# Altium schematic sheet WIFI.SchDoc
size A; SheetNumber: 11; SheetTotal: 15
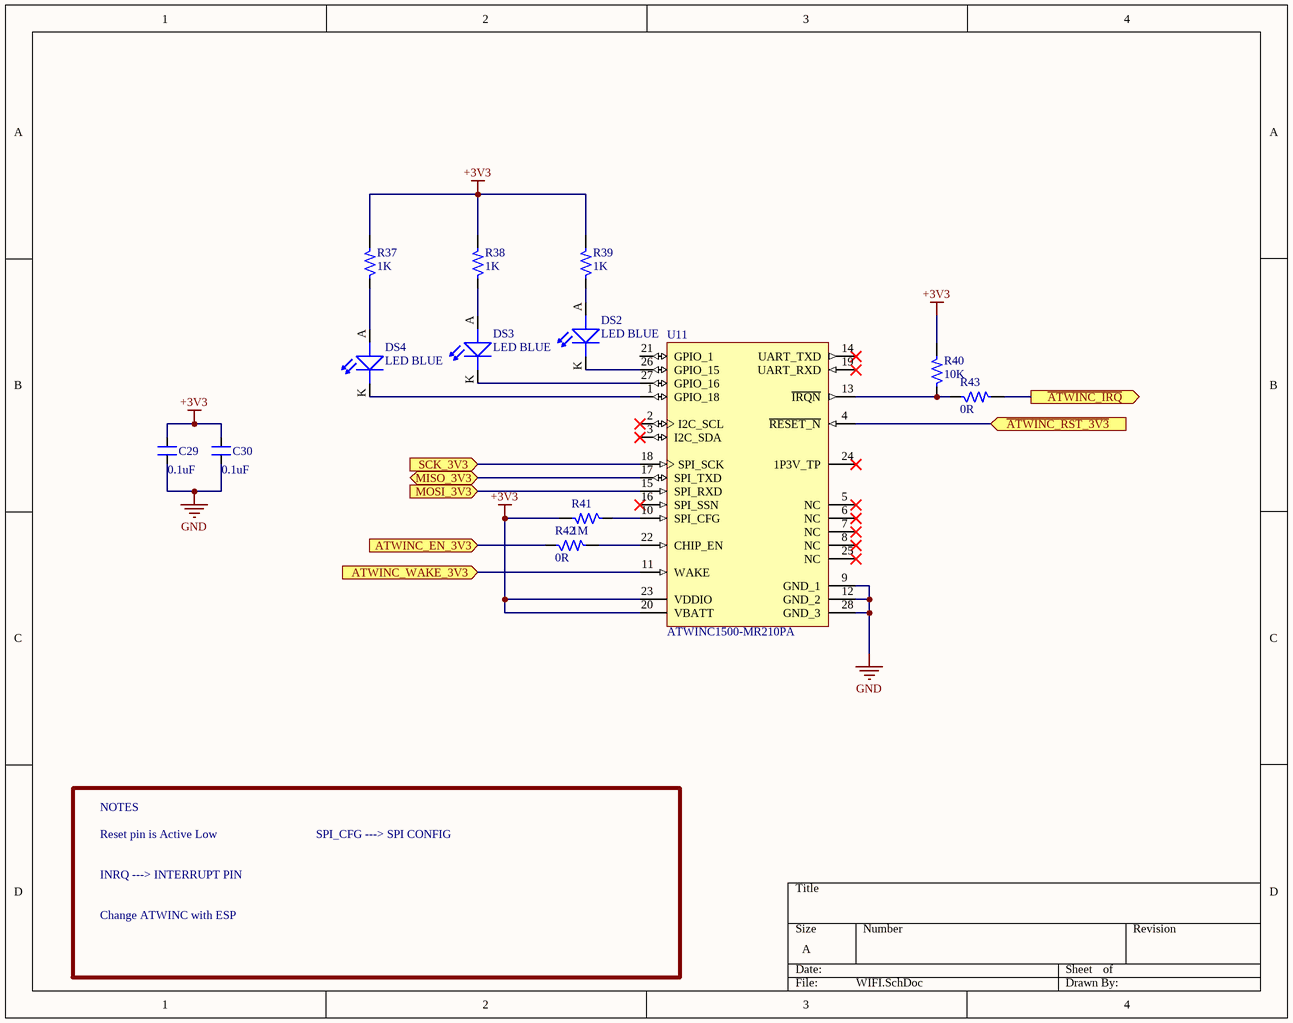
[diagram p0: WIFI.SchDoc]

## Parts
C29  0.1uF  [CAP_0805]
C30  0.1uF  [CAP_0805]
DS2  LED BLUE  [LED_0805]
DS3  LED BLUE  [LED_0805]
DS4  LED BLUE  [LED_0805]
R37  1K  [RES_0805]
R38  1K  [RES_0805]
R39  1K  [RES_0805]
R40  10K  [RES_0805]
R41  1M  [RES_0805]
R42  0R  [RES_0805]
R43  0R  [RES_0805]
U11  ATWINC1500-MR210PA  [ATML-ATWINC1500-MR210PA-28_V]

## Ports
ATWINC_EN_3V3 (in, see Block Diagram[2D], SPI Bus Transceiver[3C]), ATWINC_WAKE_3V3 (in, see Block Diagram[2C], SPI Bus Transceiver[3C]), MISO_3V3 (bidir, see Block Diagram[1C], SD Card[2B], SPI Bus Transceiver[3B]), MOSI_3V3 (in, see Block Diagram[1C], SD Card[3B], SPI Bus Transceiver[3C]), SCK_3V3 (in, see Block Diagram[1C], SD Card[2B], SPI Bus Transceiver[3C]), ~{ATWINC_IRQ} (out, see Block Diagram[2D]), ~{ATWINC_RST_3V3} (in, see Block Diagram[2D], SPI Bus Transceiver[3C])

## Nets
+3V3: C29.2 C30.2 R37.2 R38.2 R39.2 R40.2 R41.2 U11.20(VBATT) U11.23(VDDIO)
GND: C29.1 C30.1 U11.9(GND_1) U11.12(GND_2) U11.28(GND_3)
~{ATWINC_IRQ}: R43.2 ; port ~{ATWINC_IRQ}
~{ATWINC_RST_3V3}: U11.4(~{RESET_N}) ; port ~{ATWINC_RST_3V3}
ATWINC_EN_3V3: R42.1 ; port ATWINC_EN_3V3
ATWINC_WAKE_3V3: U11.11(WAKE) ; port ATWINC_WAKE_3V3
MISO_3V3: U11.17(SPI_TXD) ; port MISO_3V3
MOSI_3V3: U11.15(SPI_RXD) ; port MOSI_3V3
SCK_3V3: U11.18(SPI_SCK) ; port SCK_3V3
NetDS2_A: DS2.A(ANODE) R39.1
NetDS2_K: DS2.K(CATHODE) U11.26(GPIO_15)
NetDS3_A: DS3.A(ANODE) R38.1
NetDS3_K: DS3.K(CATHODE) U11.27(GPIO_16)
NetDS4_A: DS4.A(ANODE) R37.1
NetDS4_K: DS4.K(CATHODE) U11.1(GPIO_18)
NetR40_1: R40.1 R43.1 U11.13(~{IRQN})
NetR41_1: R41.1 U11.10(SPI_CFG)
NetR42_2: R42.2 U11.22(CHIP_EN)

Not connected (* = marked no-connect by the designer): U11 2(I2C_SCL)* 3(I2C_SDA)* 5(NC)* 6(NC)* 7(NC)* 8(NC)* 14(UART_TXD)* 16(SPI_SSN)* 19(UART_RXD)* 21(GPIO_1) 24(1P3V_TP)* 25(NC)*

## Notes on the sheet
- NOTES
- Reset pin is Active Low
- SPI_CFG ---> SPI CONFIG
- INRQ ---> INTERRUPT PIN
- Change ATWINC with ESP

## Library data of the parts
C29 C30 = CAP_0.1uF-50V-5%-0805: 0.1µF ±5% 50V Ceramic Capacitor X7R 0805 (2012 Metric); Manufacturer: AVX Corporation; Manufacturer Part Number: 08055C104JAT4A; Alternate Part Number-1: 0805B104M500; Case/Package: 0805; Supplier-1: SIRICOM; Supplier Part Number-1: 0805B104J500CT
DS2-DS4 = LED_BLUE-3V3-20mA-0805: Blue 470nm LED Indication - Discrete 3.3V 0805 (2012 Metric); Manufacturer: Vishay Lite-On; Manufacturer Part Number: LTST-C171TBKT; Alternate Part Number-1: NA; Case/Package: 0805; Supplier-1: SP ROAD; Supplier Part Number-1: LTST-C171TBKT
R37-R39 = RES_1K-0.125W-1%-0805: 1 kOhms ±1% 0.125W, 1/8W Chip Resistor 0805 (2012 Metric) Moisture Resistant Thick Film; Manufacturer: Walsin; Manufacturer Part Number: WR08X1001FTL; Case/Package: 0805; Supplier-1: SP ROAD; Supplier Part Number-1: RC0805JR-071KL; Alternate Part Number-1: WR08X1001FTL
R40 = RES_10K-0.125W-1%-0805: 10 kOhms ±1% 0.125W, 1/8W Chip Resistor 0805 (2012 Metric) Automotive AEC-Q200 Thick Film; Manufacturer: CTS; Manufacturer Part Number: WR08X1002FTL; Case/Package: 0805; Supplier-1: SIRICOM; Supplier Part Number-1: WR08X1002FTL; Alternate Part Number-1: WR08X1002FTL
R41 = RES_1M-0.125W-1%-0805: 1 MOhms ±1% 0.125W, 1/8W Chip Resistor 0805 (2012 Metric) Automotive AEC-Q200 Thick Film; Manufacturer: Walsin; Manufacturer Part Number: WR08X1004FTL; Alternate Part Number-1: 0805W8F1004T5E; Case/Package: 0805; Supplier-1: SIRICOM; Supplier Part Number-1: WR08X1004FTL
R42 R43 = RES_0R-0.125W-1%-0805: 0 Ohms Jumper 0.125W, 1/8W Chip Resistor 0805 (2012 Metric) Automotive AEC-Q200 Thick Film; Manufacturer: Walsin; Manufacturer Part Number: WR08X000PTL; Case/Package: 0805; Supplier-1: SIRICOM; Supplier Part Number-1: WR08X000PTL; Alternate Part Number-1: WR08X000PTL
U11 = ATWINC1500-MR210PA: IEEE 802.11 b/g/n IoT Module, 2.4 GHz, 2.7 to 3.6 V, -40 to 85 degC, 28-Pin Module, RoHS, Tray; VDDIO Min: 2.7 V; Frequency: 2400000000 Hz; VDDIO Max: 3.6 V; Number of Channels: 1; ComponentLink3Description: Package Specification; DatasheetVersion: Rev. 42376C; ComponentLink1URL: http://www.atmel.com/; PackageDescription: 28-Pin Module, Body 21.72 x 14.73 mm, Pitch 1.016 mm; ComponentLink2URL: http://www.atmel.com/images/atmel-42376-smartconnect-winc1500-mr210pa_datasheet.pdf; Temperature Min: -40 degC; Packing: Tray; PartNumber: ATWINC1500-MR210PA; PackageVersion: Rev. 42376C, 03/2015; ComponentLink2Description: Datasheet; ComponentLink1Description: Manufacturer URL; RoHS: TRUE; Temperature Max: 85 degC; Generic Part Number: ATWINC1500; Mounting Technology: Surface Mount; ComponentLink3URL: http://www.atmel.com/images/atmel-42376-smartconnect-winc1500-mr210pa_datasheet.pdf